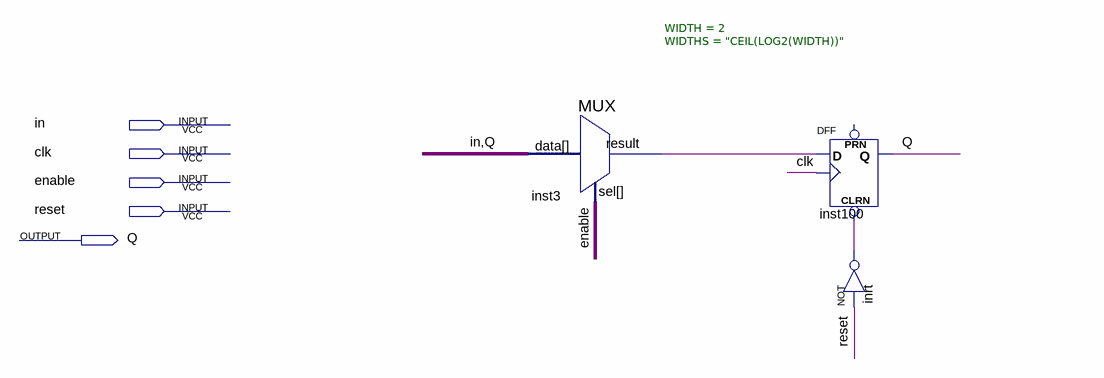
[diagram p0: schematic sheet]
// Quartus schematic dflipflop.bdf as structural Verilog: 3 symbols, 5 pins
module dflipflop (
  input  in,
  input  clk,
  input  enable,
  input  reset,
  output Q
);

  wire inrt_out, inst3_result;

  MUX #(.WIDTH(2), .WIDTHS("CEIL(LOG2(WIDTH))")) inst3 (.data({in, Q}), .sel(enable), .result(inst3_result));
  DFF inst100 (.CLRN(inrt_out), .CLK(clk), .D(inst3_result), .Q(Q));  // open: PRN
  not inrt (inrt_out, reset);
endmodule
